# Altium schematic sheet FPGA-Oscilloscope-UI.SchDoc
size C
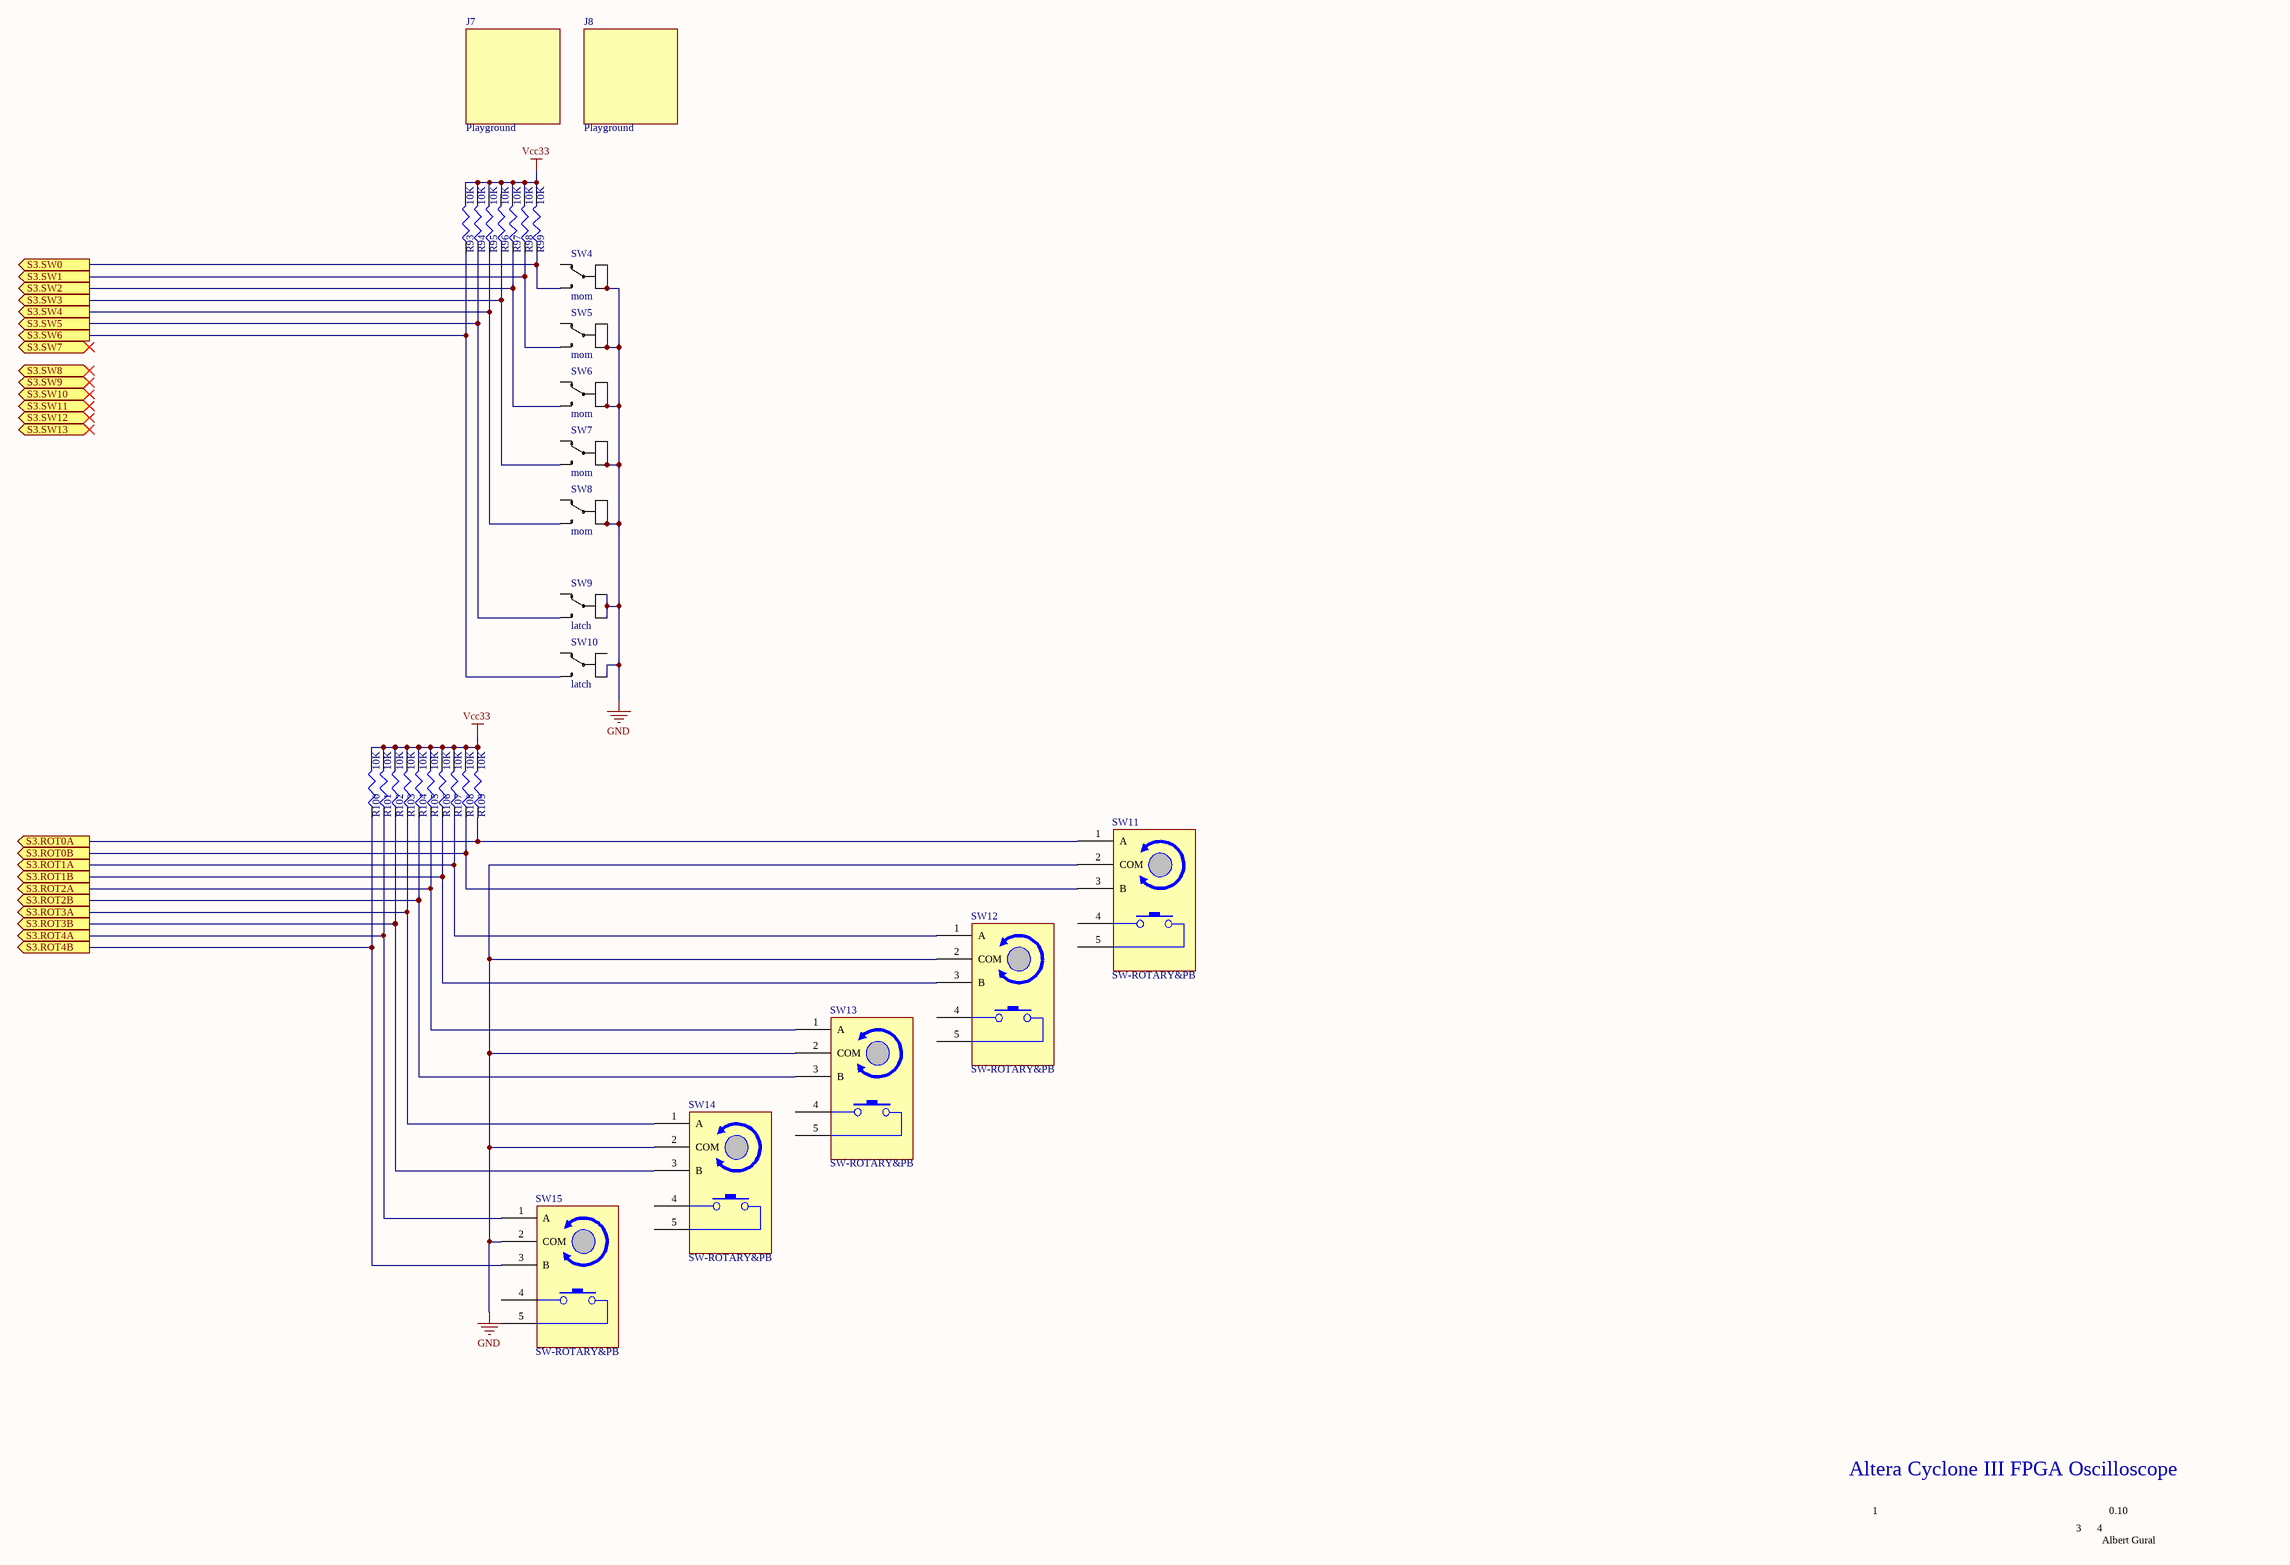
[diagram p0: FPGA-Oscilloscope-UI.SchDoc]

## Parts
J7  Playground  [20x20]
J8  Playground  [20x20]
R93  10K  [1608[0603]]
R94  10K  [1608[0603]]
R95  10K  [1608[0603]]
R96  10K  [1608[0603]]
R97  10K  [1608[0603]]
R98  10K  [1608[0603]]
R99  10K  [1608[0603]]
R100  10K  [1608[0603]]
R101  10K  [1608[0603]]
R102  10K  [1608[0603]]
R103  10K  [1608[0603]]
R104  10K  [1608[0603]]
R105  10K  [1608[0603]]
R106  10K  [1608[0603]]
R107  10K  [1608[0603]]
R108  10K  [1608[0603]]
R109  10K  [1608[0603]]
SW4  mom  [SPDT]
SW5  mom  [SPDT]
SW6  mom  [SPDT]
SW7  mom  [SPDT]
SW8  mom  [SPDT]
SW9  latch  [SPDT]
SW10  latch  [SPDT]
SW11  SW-ROTARY&PB  [ROTENCPB]
SW12  SW-ROTARY&PB  [ROTENCPB]
SW13  SW-ROTARY&PB  [ROTENCPB]
SW14  SW-ROTARY&PB  [ROTENCPB]
SW15  SW-ROTARY&PB  [ROTENCPB]

## Ports
S3.ROT0A (out), S3.ROT0B (out), S3.ROT1A (out), S3.ROT1B (out), S3.ROT2A (out), S3.ROT2B (out), S3.ROT3A (out), S3.ROT3B (out), S3.ROT4A (out), S3.ROT4B (out), S3.SW0 (out), S3.SW1 (out), S3.SW2 (out), S3.SW3 (out), S3.SW4 (out), S3.SW5 (out), S3.SW6 (out), S3.SW7 (out), S3.SW8 (out), S3.SW9 (out), S3.SW10 (out), S3.SW11 (out), S3.SW12 (out), S3.SW13 (out)

## Nets
GND: J7.PGGND(GND) J8.PGGND(GND) SW4.C SW5.C SW6.C SW7.C SW8.C SW9.C SW10.C SW11.2(COM) SW12.2(COM) SW13.2(COM) SW14.2(COM) SW15.2(COM)
Vcc33: J7.PGVCC(Vcc) J8.PGVCC(Vcc) R93.2 R94.2 R95.2 R96.2 R97.2 R98.2 R99.2 R100.2 R101.2 R102.2 R103.2 R104.2 R105.2 R106.2 R107.2 R108.2 R109.2
S3.ROT0A: R109.1 SW11.1(A) ; port S3.ROT0A
S3.ROT0B: R108.1 SW11.3(B) ; port S3.ROT0B
S3.ROT1A: R107.1 SW12.1(A) ; port S3.ROT1A
S3.ROT1B: R106.1 SW12.3(B) ; port S3.ROT1B
S3.ROT2A: R105.1 SW13.1(A) ; port S3.ROT2A
S3.ROT2B: R104.1 SW13.3(B) ; port S3.ROT2B
S3.ROT3A: R103.1 SW14.1(A) ; port S3.ROT3A
S3.ROT3B: R102.1 SW14.3(B) ; port S3.ROT3B
S3.ROT4A: R101.1 SW15.1(A) ; port S3.ROT4A
S3.ROT4B: R100.1 SW15.3(B) ; port S3.ROT4B
S3.SW0: R99.1 SW4.2 ; port S3.SW0
S3.SW1: R98.1 SW5.2 ; port S3.SW1
S3.SW2: R97.1 SW6.2 ; port S3.SW2
S3.SW3: R96.1 SW7.2 ; port S3.SW3
S3.SW4: R95.1 SW8.2 ; port S3.SW4
S3.SW5: R94.1 SW9.2 ; port S3.SW5
S3.SW6: R93.1 SW10.2 ; port S3.SW6

Not connected (* = marked no-connect by the designer): SW4 1; SW5 1; SW6 1; SW7 1; SW8 1; SW9 1; SW10 1; SW11 4 5; SW12 4 5; SW13 4 5; SW14 4 5; SW15 4 5

## Notes on the sheet
- Altera Cyclone III FPGA Oscilloscope
- 1
- 3
- 4
- Albert Gural
- 0.10

## Library data of the parts
R93-R109 = RES1
SW4-SW8 = PVB4-MOM
SW9 SW10 = PVB4-LATCH
SW11-SW15 = SW-ROTARY&PB: Rotary Encoder with Built-In Push Button